# Altium schematic sheet TopLevel.SchDoc: Top Level - Hierarchical View
size A4; Date: 2022 Fall; Address1: LK Bulls; Address2: Bagoly Zoltan; Address3: Feher Daniel; Address4: G. Varga Gabor; DocumentNumber: 1; Revision: 1.0; SheetNumber: 1; SheetTotal: 14
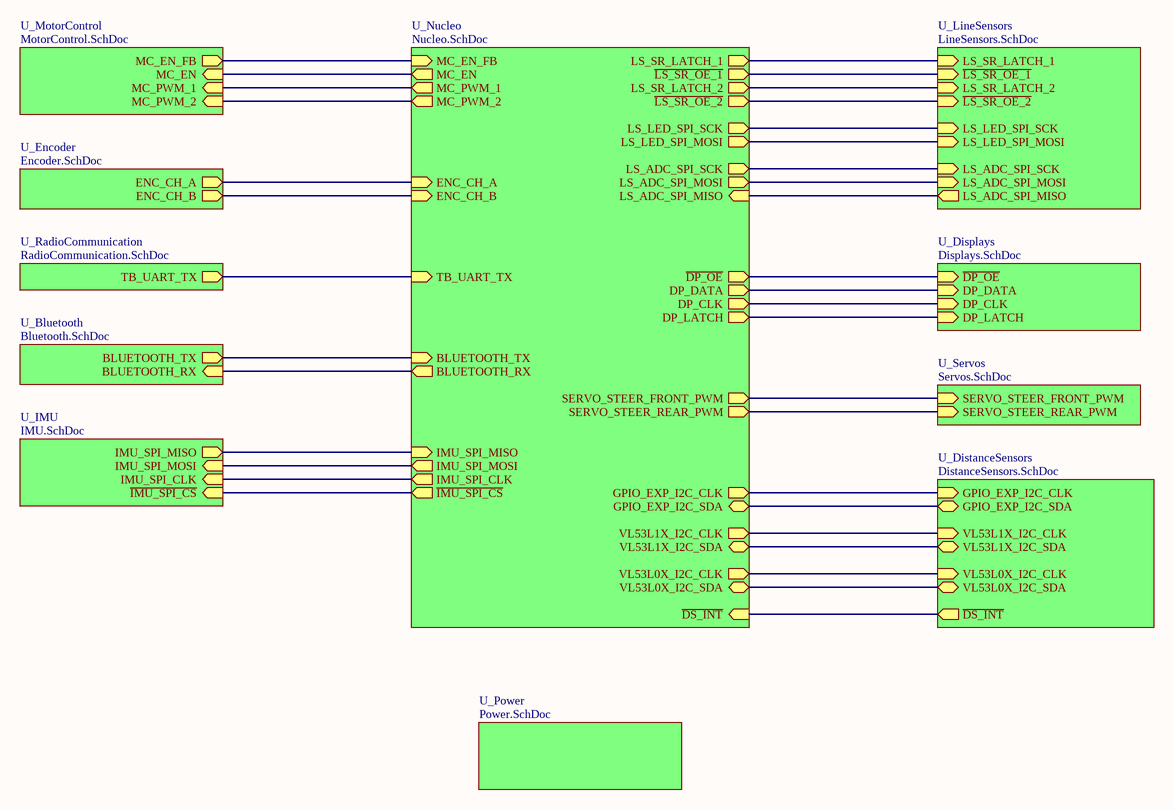
[diagram p0: TopLevel.SchDoc]

## Sub-sheets
U_Bluetooth = Bluetooth.SchDoc: BLUETOOTH_TX (out), BLUETOOTH_RX (in)
U_Displays = Displays.SchDoc: ~{DP_OE} (in), DP_DATA (in), DP_CLK (in), DP_LATCH (in)
U_DistanceSensors = DistanceSensors.SchDoc: ~{DS_INT} (out), VL53L1X_I2C_CLK (in), VL53L1X_I2C_SDA (bidir), VL53L0X_I2C_CLK (in), VL53L0X_I2C_SDA (bidir), GPIO_EXP_I2C_CLK (in), GPIO_EXP_I2C_SDA (bidir)
U_Encoder = Encoder.SchDoc: ENC_CH_B (out), ENC_CH_A (out)
U_IMU = IMU.SchDoc: IMU_SPI_MISO (out), IMU_SPI_MOSI (in), IMU_SPI_CLK (in), ~{IMU_SPI_CS} (in)
U_LineSensors = LineSensors.SchDoc: LS_LED_SPI_MOSI (in), ~{LS_SR_OE_1} (in), LS_SR_LATCH_1 (in), LS_LED_SPI_SCK (in), LS_SR_LATCH_2 (in), LS_ADC_SPI_MOSI (in), LS_ADC_SPI_MISO (out), LS_ADC_SPI_SCK (in), ~{LS_SR_OE_2} (in)
U_MotorControl = MotorControl.SchDoc: MC_EN_FB (out), MC_EN (in), MC_PWM_1 (in), MC_PWM_2 (in)
U_Nucleo = Nucleo.SchDoc: LS_SR_LATCH_1 (out), LS_SR_LATCH_2 (out), DP_DATA (out), DP_CLK (out), DP_LATCH (out), TB_UART_TX (in), ENC_CH_B (in), ENC_CH_A (in), MC_EN_FB (in), MC_EN (out), MC_PWM_1 (out), MC_PWM_2 (out), SERVO_STEER_FRONT_PWM (out), SERVO_STEER_REAR_PWM (out), BLUETOOTH_TX (in), BLUETOOTH_RX (out), IMU_SPI_MISO (in), IMU_SPI_MOSI (out), IMU_SPI_CLK (out), LS_LED_SPI_MOSI (out), LS_LED_SPI_SCK (out), LS_ADC_SPI_MOSI (out), LS_ADC_SPI_MISO (in), LS_ADC_SPI_SCK (out), ~{IMU_SPI_CS} (out), ~{DP_OE} (out), ~{LS_SR_OE_1} (out), ~{LS_SR_OE_2} (out), ~{DS_INT} (in), VL53L1X_I2C_CLK (out), VL53L1X_I2C_SDA (bidir), VL53L0X_I2C_CLK (out), VL53L0X_I2C_SDA (bidir), GPIO_EXP_I2C_CLK (out), GPIO_EXP_I2C_SDA (bidir)
U_Power = Power.SchDoc: no entries
U_RadioCommunication = RadioCommunication.SchDoc: TB_UART_TX (out)
U_Servos = Servos.SchDoc: SERVO_STEER_FRONT_PWM (in), SERVO_STEER_REAR_PWM (in)

## Nets
(unnamed): sheet U_Nucleo/LS_SR_LATCH_1, sheet U_LineSensors/LS_SR_LATCH_1
(unnamed): sheet U_Nucleo/LS_SR_LATCH_2, sheet U_LineSensors/LS_SR_LATCH_2
(unnamed): sheet U_Nucleo/DP_DATA, sheet U_Displays/DP_DATA
(unnamed): sheet U_Nucleo/DP_CLK, sheet U_Displays/DP_CLK
(unnamed): sheet U_Nucleo/DP_LATCH, sheet U_Displays/DP_LATCH
(unnamed): sheet U_Nucleo/TB_UART_TX, sheet U_RadioCommunication/TB_UART_TX
(unnamed): sheet U_Nucleo/ENC_CH_B, sheet U_Encoder/ENC_CH_B
(unnamed): sheet U_Nucleo/ENC_CH_A, sheet U_Encoder/ENC_CH_A
(unnamed): sheet U_Nucleo/MC_EN_FB, sheet U_MotorControl/MC_EN_FB
(unnamed): sheet U_Nucleo/MC_EN, sheet U_MotorControl/MC_EN
(unnamed): sheet U_Nucleo/MC_PWM_1, sheet U_MotorControl/MC_PWM_1
(unnamed): sheet U_Nucleo/MC_PWM_2, sheet U_MotorControl/MC_PWM_2
(unnamed): sheet U_Nucleo/SERVO_STEER_FRONT_PWM, sheet U_Servos/SERVO_STEER_FRONT_PWM
(unnamed): sheet U_Nucleo/SERVO_STEER_REAR_PWM, sheet U_Servos/SERVO_STEER_REAR_PWM
(unnamed): sheet U_Nucleo/BLUETOOTH_TX, sheet U_Bluetooth/BLUETOOTH_TX
(unnamed): sheet U_Nucleo/BLUETOOTH_RX, sheet U_Bluetooth/BLUETOOTH_RX
(unnamed): sheet U_Nucleo/IMU_SPI_MISO, sheet U_IMU/IMU_SPI_MISO
(unnamed): sheet U_Nucleo/IMU_SPI_MOSI, sheet U_IMU/IMU_SPI_MOSI
(unnamed): sheet U_Nucleo/IMU_SPI_CLK, sheet U_IMU/IMU_SPI_CLK
(unnamed): sheet U_Nucleo/LS_LED_SPI_MOSI, sheet U_LineSensors/LS_LED_SPI_MOSI
(unnamed): sheet U_Nucleo/LS_LED_SPI_SCK, sheet U_LineSensors/LS_LED_SPI_SCK
(unnamed): sheet U_Nucleo/LS_ADC_SPI_MOSI, sheet U_LineSensors/LS_ADC_SPI_MOSI
(unnamed): sheet U_Nucleo/LS_ADC_SPI_MISO, sheet U_LineSensors/LS_ADC_SPI_MISO
(unnamed): sheet U_Nucleo/LS_ADC_SPI_SCK, sheet U_LineSensors/LS_ADC_SPI_SCK
(unnamed): sheet U_Nucleo/~{IMU_SPI_CS}, sheet U_IMU/~{IMU_SPI_CS}
(unnamed): sheet U_Nucleo/~{DP_OE}, sheet U_Displays/~{DP_OE}
(unnamed): sheet U_Nucleo/~{LS_SR_OE_1}, sheet U_LineSensors/~{LS_SR_OE_1}
(unnamed): sheet U_Nucleo/~{LS_SR_OE_2}, sheet U_LineSensors/~{LS_SR_OE_2}
(unnamed): sheet U_Nucleo/~{DS_INT}, sheet U_DistanceSensors/~{DS_INT}
(unnamed): sheet U_Nucleo/VL53L1X_I2C_CLK, sheet U_DistanceSensors/VL53L1X_I2C_CLK
(unnamed): sheet U_Nucleo/VL53L1X_I2C_SDA, sheet U_DistanceSensors/VL53L1X_I2C_SDA
(unnamed): sheet U_Nucleo/VL53L0X_I2C_CLK, sheet U_DistanceSensors/VL53L0X_I2C_CLK
(unnamed): sheet U_Nucleo/VL53L0X_I2C_SDA, sheet U_DistanceSensors/VL53L0X_I2C_SDA
(unnamed): sheet U_Nucleo/GPIO_EXP_I2C_CLK, sheet U_DistanceSensors/GPIO_EXP_I2C_CLK
(unnamed): sheet U_Nucleo/GPIO_EXP_I2C_SDA, sheet U_DistanceSensors/GPIO_EXP_I2C_SDA

## Notes on the sheet
- Title
- Size:
- Date:
- A4
- Number:
- Revision:
- Sheet
- of
- Designed by:
- File: